# Altium schematic sheet Current_Sensor.SchDoc
size A; SheetNumber: 4; SheetTotal: 6
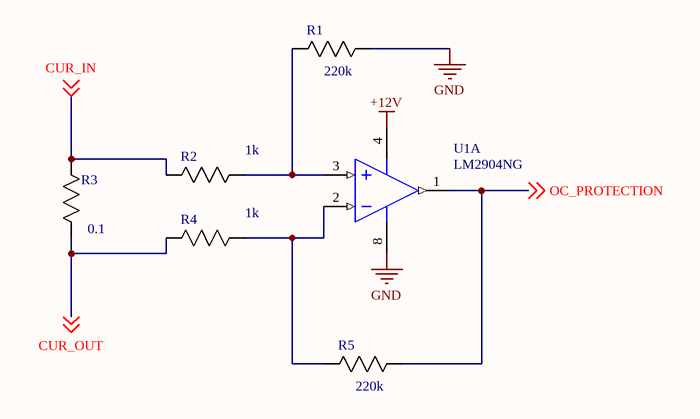
[diagram p0: Current_Sensor.SchDoc]

## Parts
R1  Resistance: 220k  [RES_AC03_VIS]  (hidden comment: AC03000001000JAC00)
R2  Resistance: 1k  [RES_AC03_VIS]  (hidden comment: AC03000001000JAC00)
R3  Resistance: 0.1  [RES_AC03_VIS]  (hidden comment: AC03000001000JAC00)
R4  Resistance: 1k  [RES_AC03_VIS]  (hidden comment: AC03000001000JAC00)
R5  Resistance: 220k  [RES_AC03_VIS]  (hidden comment: AC03000001000JAC00)
U1  LM2904NG  [ONSC-PDIP-8-626-05_M]  (part A of 2)

## Nets
+12V: U1.4(VEE/GND)
GND: R1.2 U1.8(VCC)
CUR_IN: R2.1 R3.2 ; off-sheet CUR_IN
CUR_OUT: R3.1 R4.1 ; off-sheet CUR_OUT
OC_PROTECTION: R5.2 U1.1(OUTA) ; off-sheet OC_PROTECTION
NetR1_1: R1.1 R2.2 U1.3(INA+)
NetR4_2: R4.2 R5.1 U1.2(INA-)

## Library data of the parts
R1-R5 = CMP-00030-39746358-1: AC03000001000JAC00 VISHAY AC03000001000JAC00 Through Hole Resistor, 100 ohm, Axial Leaded, 3 W, 5%, AC Series; Voltage Rating: 17V; Lead Diameter: 800µm; Temperature Coefficient: -80ppm/°C; Max Power Dissipation: 3W; Features: Flame Retardant Coating; Number of Pins: 2; Military Standard: Not; Voltage Rating (DC): 17V; Termination: Axial; Width: 4.8mm; Tolerance: 5%; Diameter: 4.8mm; Schedule B: 8533210080, 8533210080; Contact Plating: Tin; NexarPartId: 39746358; RoHS: Compliant; Composition: Wirewound; Max Operating Temperature: 275°C; Packaging: Cut Tape (CT); Number of Terminations: 2; REACH SVHC: Unknown; Power Rating: 3W; Case/Package: Conformal; Radiation Hardening: No; Min Operating Temperature: 0°C; Length: 13mm
U1 = CMP-1310-00110-1: Single Supply Dual Operational Amplifier, 3 to 32 V, -40 to 105 degC, 8-Pin PDIP, Pb-Free, Tube; Manufacturer: On Semiconductor; VCC Max (V): 32; VCC Min (V): 3; ComponentLink2Description: Datasheet; PackageVersion: Rev. M, 04/2010; Packing: Tube; DatasheetVersion: Rev. 27; ComponentLink3URL: http://www.onsemi.com/pub_link/Collateral/LM211-D.PDF; Mounting Technology: Through Hole; PartNumber: LM2904NG; PackageDescription: 8-Pin Plastic Dual-In Line Package, Body 9.52 x 6.605 mm, Pitch 2.54 mm; ComponentLink3Description: Package Specification; ComponentLink1Description: Manufacturer URL; ComponentLink2URL: http://www.onsemi.cn/pub_link/Collateral/LM358-D.PDF; ComponentLink1URL: http://www.onsemi.com/; PackageReference: PDIP-8-626-05; RoHS: TRUE